# EAGLE design Dosing_CTRLR_HMI (EAGLE 9.6.2)
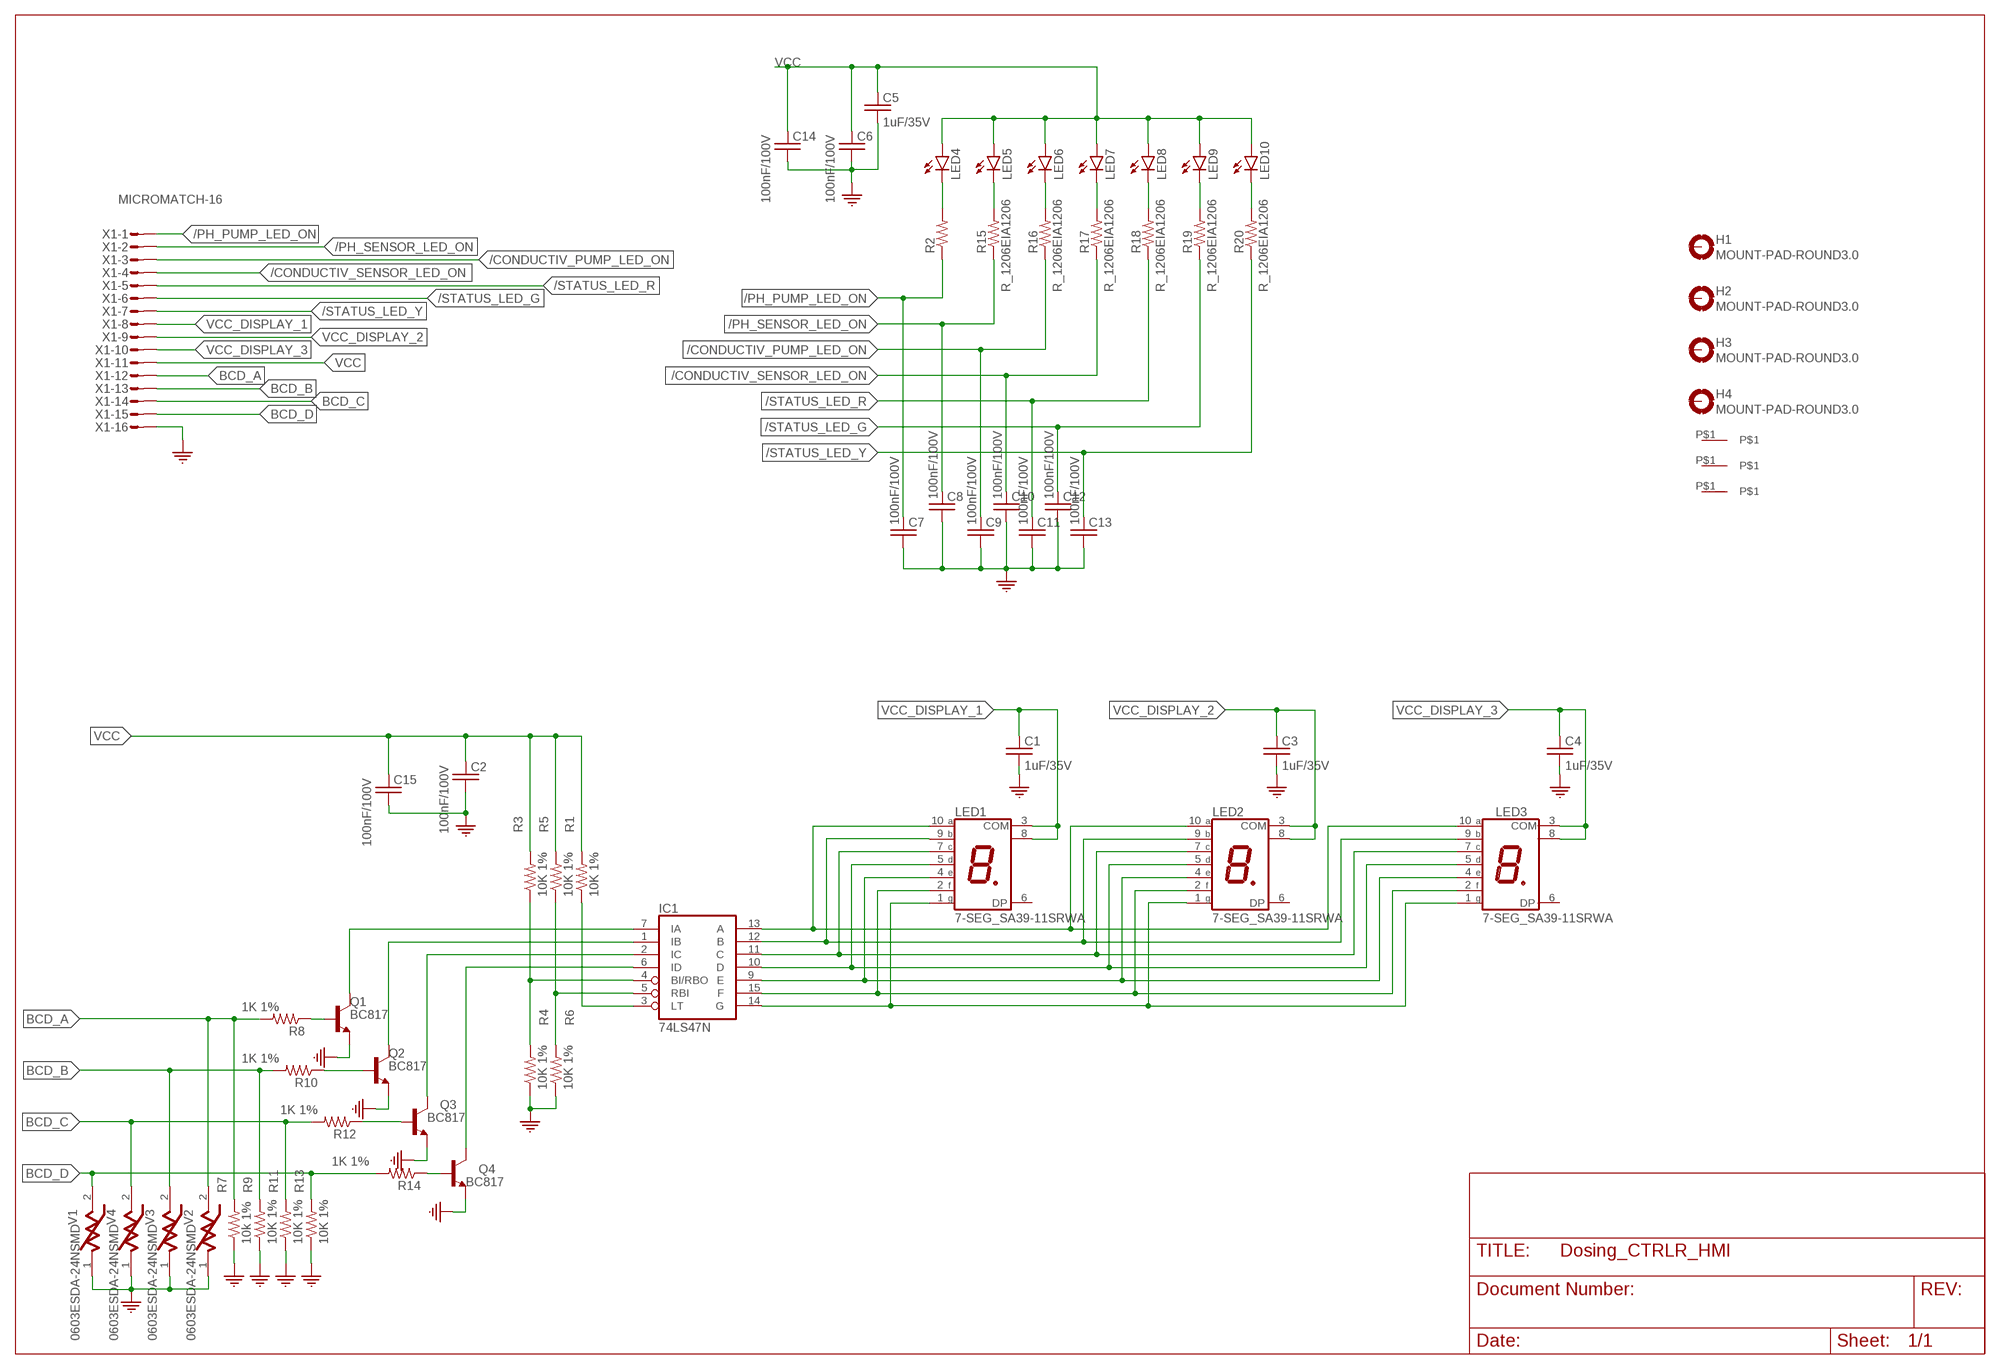
[diagram p0: schematic, sheet 1]

## Parts
C1  1uF/35V  C_0603EIA0603  [EIA0603]
C2  100nF/100V  C_0603EIA0603  [EIA0603]
C3  1uF/35V  C_0603EIA0603  [EIA0603]
C4  1uF/35V  C_0603EIA0603  [EIA0603]
C5  1uF/35V  C_0603EIA0603  [EIA0603]
C6  100nF/100V  C_0603EIA0603  [EIA0603]
C7  100nF/100V  C_0603EIA0603  [EIA0603]
C8  100nF/100V  C_0603EIA0603  [EIA0603]
C9  100nF/100V  C_0603EIA0603  [EIA0603]
C10  100nF/100V  C_0603EIA0603  [EIA0603]
C11  100nF/100V  C_0603EIA0603  [EIA0603]
C12  100nF/100V  C_0603EIA0603  [EIA0603]
C13  100nF/100V  C_0603EIA0603  [EIA0603]
C14  100nF/100V  C_0603EIA0603  [EIA0603]
C15  100nF/100V  C_0603EIA0603  [EIA0603]
FID1  FIDUCIAL  [FIDUCIAL]
FID2  FIDUCIAL  [FIDUCIAL]
FID3  FIDUCIAL  [FIDUCIAL]
H1  MOUNT-PAD-ROUND3.0  [3,0-PAD]
H2  MOUNT-PAD-ROUND3.0  [3,0-PAD]
H3  MOUNT-PAD-ROUND3.0  [3,0-PAD]
H4  MOUNT-PAD-ROUND3.0  [3,0-PAD]
IC1  74LS47N  [DIL16]
LED1  7-SEG_SA39-11SRWA  [SA39-11SRWA]
LED2  7-SEG_SA39-11SRWA  [SA39-11SRWA]
LED3  7-SEG_SA39-11SRWA  [SA39-11SRWA]
LED4  LED5MM  [LED5MM]
LED5  LED5MM  [LED5MM]
LED6  LED5MM  [LED5MM]
LED7  LED5MM  [LED5MM]
LED8  LED5MM  [LED5MM]
LED9  LED5MM  [LED5MM]
LED10  LED5MM  [LED5MM]
Q1  BC817  [SOT23]
Q2  BC817  [SOT23]
Q3  BC817  [SOT23]
Q4  BC817  [SOT23]
R1  10K 1%  R_0603  [EIA0603]
R2  R_1206EIA1206  [EIA1206]
R3  10K 1%  R_0603  [EIA0603]
R4  10K 1%  R_0603  [EIA0603]
R5  10K 1%  R_0603  [EIA0603]
R6  10K 1%  R_0603  [EIA0603]
R7  10k 1%  R_0603  [EIA0603]
R8  1K 1%  R_0603  [EIA0603]
R9  10K 1%  R_0603  [EIA0603]
R10  1K 1%  R_0603  [EIA0603]
R11  10K 1%  R_0603  [EIA0603]
R12  1K 1%  R_0603  [EIA0603]
R13  10K 1%  R_0603  [EIA0603]
R14  1K 1%  R_0603  [EIA0603]
R15  R_1206EIA1206  [EIA1206]
R16  R_1206EIA1206  [EIA1206]
R17  R_1206EIA1206  [EIA1206]
R18  R_1206EIA1206  [EIA1206]
R19  R_1206EIA1206  [EIA1206]
R20  R_1206EIA1206  [EIA1206]
V1  0603ESDA-24NSMD  [EIA0603]
V2  0603ESDA-24NSMD  [EIA0603]
V3  0603ESDA-24NSMD  [EIA0603]
V4  0603ESDA-24NSMD  [EIA0603]
X1  MICROMATCH-16  [MICROMATCH-16]

## Nets
/CONDUCTIV_PUMP_LED_ON: C9.1 R16.1 X1.3
/CONDUCTIV_SENSOR_LED_ON: C10.1 R17.1 X1.4
/PH_PUMP_LED_ON: C7.1 R2.1 X1.1
/PH_SENSOR_LED_ON: C8.1 R15.1 X1.2
/STATUS_LED_G: C12.1 R19.1 X1.6
/STATUS_LED_R: C11.1 R18.1 X1.5
/STATUS_LED_Y: C13.1 R20.1 X1.7
BCD_A: R7.2 R8.2 V2.2 X1.12
BCD_B: R9.2 R10.2 V3.2 X1.13
BCD_C: R11.2 R12.2 V4.2 X1.14
BCD_D: R13.2 R14.2 V1.2 X1.15
GND: C1.2 C2.2 C3.2 C4.2 C5.2 C6.2 C7.2 C8.2 C9.2 C10.2 C11.2 C12.2 C13.2 C14.2 C15.2 Q1.2(E) Q2.2(E) Q3.2(E) Q4.2(E) R4.1 R6.1 R7.1 R9.1 R11.1 R13.1 V1.1 V2.1 V3.1 V4.1 X1.16
N$1: IC1.13(A) LED1.10(A) LED2.10(A) LED3.10(A)
N$2: IC1.12(B) LED1.9(B) LED2.9(B) LED3.9(B)
N$3: IC1.11(C) LED1.7(C) LED2.7(C) LED3.7(C)
N$4: IC1.10(D) LED1.5(D) LED2.5(D) LED3.5(D)
N$5: IC1.9(E) LED1.4(E) LED2.4(E) LED3.4(E)
N$6: IC1.15(F) LED1.2(F) LED2.2(F) LED3.2(F)
N$7: IC1.14(G) LED1.1(G) LED2.1(G) LED3.1(G)
N$8: IC1.4(BI/RBO) R3.1 R4.2
N$9: IC1.3(LT) R1.1
N$10: Q4.1(B) R14.1
N$11: IC1.5(RBI) R5.1 R6.2
N$13: Q3.1(B) R12.1
N$14: LED4.K(C) R2.2
N$15: Q2.1(B) R10.1
N$16: LED5.K(C) R15.2
N$17: LED6.K(C) R16.2
N$18: Q1.1(B) R8.1
N$19: IC1.7(IA) Q1.3(C)
N$20: IC1.1(IB) Q2.3(C)
N$21: IC1.2(IC) Q3.3(C)
N$22: IC1.6(ID) Q4.3(C)
N$23: LED7.K(C) R17.2
N$24: LED8.K(C) R18.2
N$25: LED9.K(C) R19.2
N$26: LED10.K(C) R20.2
VCC: C2.1 C5.1 C6.1 C14.1 C15.1 LED4.A LED5.A LED6.A LED7.A LED8.A LED9.A LED10.A R1.2 R3.2 R5.2 X1.11
VCC_DISPLAY_1: C1.1 LED1.3(COM) LED1.8(COM) X1.8
VCC_DISPLAY_2: C3.1 LED2.3(COM) LED2.8(COM) X1.9
VCC_DISPLAY_3: C4.1 LED3.3(COM) LED3.8(COM) X1.10
Unconnected: FID1.P$1 FID2.P$1 FID3.P$1 H1.B3,0(MOUNT) H2.B3,0(MOUNT) H3.B3,0(MOUNT) H4.B3,0(MOUNT) LED1.6(DP) LED2.6(DP) LED3.6(DP)

## Power pins joined to a net without a drawn wire
GND: IC1.8(GND)
VCC: IC1.16(VCC)

## Library data of the parts
C1-C15 = Labops_Lib_AH:C_0603
FID1-FID3 = Labops_Lib_AH:FIDUCIAL
H1-H4 = holes:MOUNT-PAD-ROUND: MOUNTING PAD, round
IC1 = 74xx-us:74*47: BCD to seven segment DECODER/DRIVER Source: http://www.ee.washington.edu/stores/DataSheets/74ls/74ls47.pdf
LED1-LED3 = display-kingbright:7-SEG_: Kingbright 14.2mm (0.56 INCH) SINGLE DIGIT NUMERIC DUISPLAY Source: SA56-11EWA(Ver1189471036.pdf; OC_FARNELL: unknown; OC_NEWARK: unknown
LED4-LED10 = led:LED: LED OSRAM: - CHIPLED LG R971, LG N971, LY N971, LG Q971, LY Q971, LO R971, LY R971 LH N974, LH R974 LS Q976, LO Q976, LY Q976 LO Q996 - Hyper CHIPLED LW Q18S LB Q993, LB Q99A, LB R99A - SideLED LS A670, LO A670, LY A670, LG A670, LP A670 LB A673, LV A673, LT A673, LW A673 LH A674 LY A675 LS A676, LA A676, LO A676, LY A676, LW A676 LS A679, LY A679, LG A679 - Hyper Micro SIDELED® LS Y876, LA Y876, LO Y876, LY Y876 LT Y87S - SmartLED LW L88C, LW L88S LB L89C, LB L89S, LG L890 LS L89K, LO L89K, LY L89K LS L896, LA L896, LO L896, LY L896 - TOPLED LS T670, LO T670, LY T670, LG T670, LP T670 LSG T670, LSP T670, LSY T670, LOP T670, LYG T670 LG T671, LOG T671, LSG T671 LB T673, LV T673, LT T673, LW T673 LH T674 LS T676, LA T676, LO T676, LY T676, LB T676, LH T676, LSB T676, LW T676 LB T67C, LV T67C, LT T67C, LS T67K, LO T67K, LY T67K, LW E67C LS E67B, LA E67B, LO E67B, LY E67B, LB E67C, LV E67C, LT E67C LW T67C LS T679, LY T679, LG T679 LS T770, LO T770, LY T770, LG T770, LP T770 LB T773, LV T773, LT T773, LW T773 LH T774 LS E675, LA E675, LY E675, LS T675 LS T776, LA T776, LO T776, LY T776, LB T776 LHGB T686 LT T68C, LB T68C - Hyper Mini TOPLED® LB M676 - Mini TOPLED Santana® LG M470 LS M47K, LO M47K, LY M47K Source: http://www.osram.convergy.de LUXEON: - LUMILED® LXK2-PW12-R00, LXK2-PW12-S00, LXK2-PW14-U00, LXK2-PW14-V00 LXK2-PM12-R00, LXK2-PM12-S00, LXK2-PM14-U00 LXK2-PE12-Q00, LXK2-PE12-R00, LXK2-PE12-S00, LXK2-PE14-T00, LXK2-PE14-U00 LXK2-PB12-K00, LXK2-PB12-L00, LXK2-PB12-M00, LXK2-PB14-N00, LXK2-PB14-P00, LXK2-PB14-Q00 LXK2-PR12-L00, LXK2-PR12-M00, LXK2-PR14-Q00, LXK2-PR14-R00 LXK2-PD12-Q00, LXK2-PD12-R00, LXK2-PD12-S00 LXK2-PH12-R00, LXK2-PH12-S00 LXK2-PL12-P00, LXK2-PL12-Q00, LXK2-PL12-R00 Source: www.luxeon.com KINGBRIGHT: KA-3528ASYC Source: www.kingbright.com
Q1-Q4 = Labops_Lib_AH:BC817; DESCRIPTION: Transistor BJT NPN SOT23 45V 0.5A; MFN: BC817; MFR: NXP; PRICE-1: 0.03; SUPPLIER-1: Mouser
R1 R3-R14 = Labops_Lib_AH:R_0603; MFN: Open Source 0603
R2 R15-R20 = Labops_Lib_AH:R_1206; MFN: Open Source R1206
V1-V4 = Labops_Lib_AH:0603ESDA-24N; DESCRIPTION: aristor 0603 SMD Bidirectional 50V 24V; MFN: 0603ESDA-24N; MFR: Bourns; SUPPLIER-1: LCSC
X1 = con-amp-micromatch:MICROMATCH-16: MicroMaTch 16 8-215464-6 / 1-215464-6 Drawing Number C-215464 DDEController.pdf; MF: FARNELL; MPN: 8-215464-6; OC_FARNELL: 3784680; OC_NEWARK: 26H3309

## Board
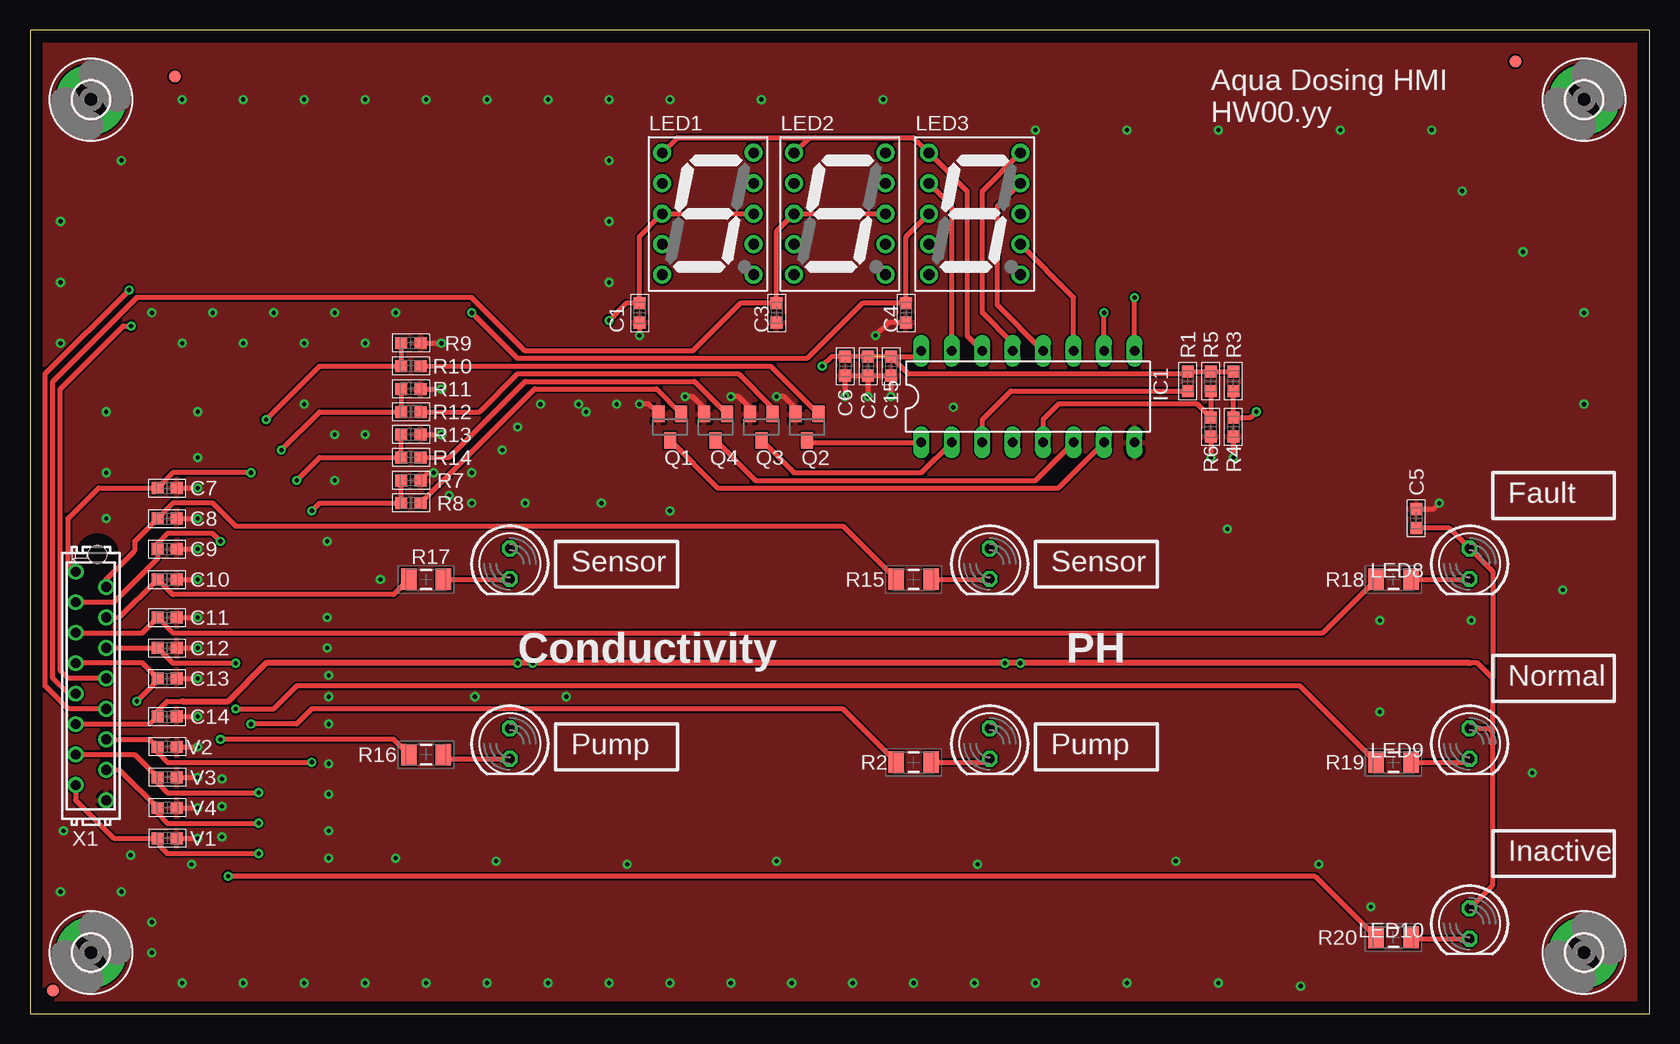
[diagram p1: board, top side]
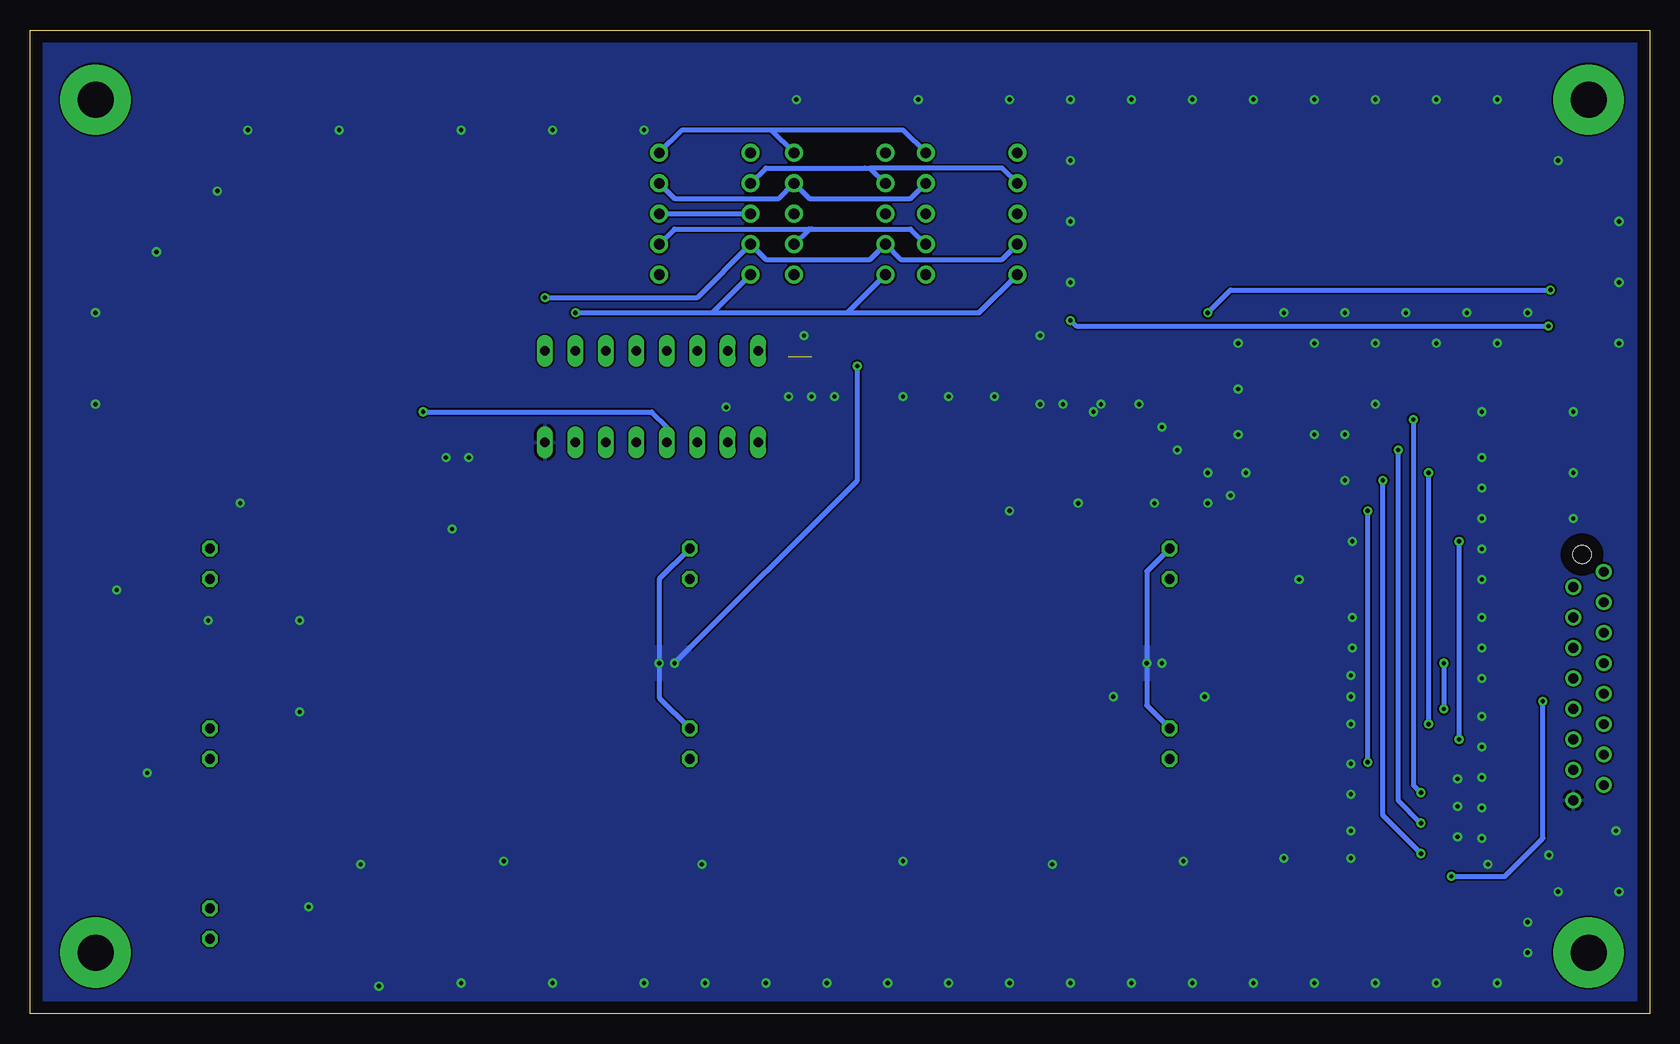
[diagram p2: board, bottom side, seen from below]

Size 135 x 82 mm. Coordinates in mm from the lower left corner, seen from the top.
Outline: 0,0 135,0 135,82 0,82 0,0
Copper layers (1*16): Top 0.035mm / dielectric 1.5mm / Bottom 0.035mm
Design rules "default *": minimum track width 6mil, minimum drill 0.35mm, track to track 6mil, track to pad 6mil, pad to pad 6mil, via to via 6mil, smd to smd 6mil, copper to edge 40mil, drill to drill 6mil, minimum pad ring 10mil, minimum via ring 8mil, stop-mask expansion 4mil, vias tented up to drill 0.35mm, thermal gap 10mil

### Footprints (pad centres in the part's own frame; a part is rotated, then mirrored left to right if it is on the bottom)
EIA0603 = smd 1 x 1: 1 -0.8,0; 2 0.8,0
FIDUCIAL = smd 1 x 1: P$1 0,0
3,0-PAD = drill 3 pad 5.842: B3,0 0,0
DIL16 = drill 0.813 long: 1 -8.89,-3.81; 2 -6.35,-3.81; 3 -3.81,-3.81; 4 -1.27,-3.81; 5 1.27,-3.81; 6 3.81,-3.81; 7 6.35,-3.81; 8 8.89,-3.81; 9 8.89,3.81; 10 6.35,3.81; 11 3.81,3.81; 12 1.27,3.81; 13 -1.27,3.81; 14 -3.81,3.81; 15 -6.35,3.81; 16 -8.89,3.81
SA39-11SRWA = drill 0.9 pad 1.5: 1 -3.81,5.08; 2 -3.81,2.54; 3 -3.81,0; 4 -3.81,-2.54; 5 -3.81,-5.08; 6 3.81,-5.08; 7 3.81,-2.54; 8 3.81,0; 9 3.81,2.54; 10 3.81,5.08
LED5MM = drill 0.813 octagon: A -1.27,0; K 1.27,0
SOT23 = smd 1 x 1.4: 1 -0.95,-1.1; 2 0.95,-1.1; 3 0,1.1
EIA1206 = smd 1.3 x 1.8: 1 -1.45,0; 2 1.45,0
MICROMATCH-16 = drill 0.813: 1 9.525,1.27; 2 8.255,-1.27; 3 6.985,1.27; 4 5.715,-1.27; 5 4.445,1.27; 6 3.175,-1.27; 7 1.905,1.27; 8 0.635,-1.27; 9 -0.635,1.27; 10 -1.905,-1.27; 11 -3.175,1.27; 12 -4.445,-1.27; 13 -5.715,1.27; 14 -6.985,-1.27; 15 -8.255,1.27; 16 -9.525,-1.27 | hole 1.5: 10.97,-0.55

### Placement (x,y rotation side)
C1  50.8,58.42 270 top
C2  69.85,53.98 270 top
C3  62.23,58.42 270 top
C4  73.03,58.42 270 top
C5  115.57,41.27 90 top
C6  67.94,53.98 270 top
C7  11.43,43.81 0 top
C8  11.43,41.27 0 top
C9  11.43,38.73 0 top
C10  11.43,36.2 0 top
C11  11.43,33.02 0 top
C12  11.43,30.48 0 top
C13  11.43,27.94 0 top
C14  11.43,24.77 0 top
C15  71.75,53.98 270 top
FID1  1.91,1.91 0 top
FID2  123.83,79.38 0 top
FID3  12.06,78.11 0 top
H1  129.54,5.08 0 top
H2  129.54,76.2 0 top
H3  5.08,76.2 0 top
H4  5.08,5.08 0 top
IC1  83.19,51.44 0 top
LED1  56.52,66.67 0 top
LED2  67.5,66.67 0 top
LED3  78.74,66.67 0 top
LED4  80,22.5 270 top
LED5  80,37.5 270 top
LED6  40,22.5 270 top
LED7  40,37.5 270 top
LED8  120,37.5 270 top
LED9  120,22.5 270 top
LED10  120,7.5 270 top
Q1  53.34,48.9 180 top
Q2  64.77,48.9 180 top
Q3  60.96,48.9 180 top
Q4  57.15,48.9 180 top
R1  96.52,52.7 90 top
R2  73.66,20.95 0 top
R3  100.33,52.7 90 top
R4  100.33,48.9 90 top
R5  98.42,52.7 90 top
R6  98.42,48.9 90 top
R7  31.75,44.45 180 top
R8  31.75,42.55 180 top
R9  31.75,55.88 180 top
R10  31.75,53.98 180 top
R11  31.75,52.07 180 top
R12  31.75,50.16 180 top
R13  31.75,48.26 180 top
R14  31.75,46.35 180 top
R15  73.66,36.2 0 top
R16  33.02,21.59 0 top
R17  33.02,36.2 0 top
R18  113.67,36.2 0 top
R19  113.67,20.95 0 top
R20  113.67,6.35 0 top
V1  11.43,14.61 180 top
V2  11.43,22.23 180 top
V3  11.43,19.68 180 top
V4  11.43,17.14 180 top
X1  5.08,27.3 90 top

### Tracks (layer width: path | path; a pad name or v marks a point on that pad's centre or on a via)
/CONDUCTIV_PUMP_LED_ON  (via drill 0.35)
  Top 0.406: X1.3 6.99,34.29 10.63,37.94 C9.1 10.63,39.2 11.43,40.01 15.24,40.01 v15.88,39.37 | R16.1 30.3,22.86 v15.88,22.86
  Bottom 0.406: v15.88,22.86 v15.88,39.37
/CONDUCTIV_SENSOR_LED_ON
  Top 0.406: R17.1 30.3,34.92 11.9,34.92 C10.1 7.46,33.02 X1.4
/PH_PUMP_LED_ON  (via drill 0.35)
  Top 0.406: R2.1 67.77,25.4 23.5,25.4 22.23,24.13 v18.41,24.13 | X1.1 3.17,37.47 3.17,41.27 5.71,43.81 C7.1 11.9,45.09 v18.41,45.09
  Bottom 0.406: v18.41,24.13 v18.41,45.09
/PH_SENSOR_LED_ON
  Top 0.406: R15.1 67.77,40.64 17.14,40.64 15.24,42.55 11.9,42.55 C8.1 8.72,39.37 8.72,38.57 6.35,36.2 X1.2
/STATUS_LED_G  (via drill 0.35)
  Top 0.406: X1.6 C12.1 11.9,29.21 v17.14,29.21 | R19.1 105.86,27.3 22.23,27.3 20.32,25.4 v17.14,25.4
  Bottom 0.406: v17.14,29.21 v17.14,25.4
/STATUS_LED_R
  Top 0.406: R18.1 107.77,31.75 11.9,31.75 C11.1 9.36,31.75 X1.5
/STATUS_LED_Y  (via drill 0.35)
  Top 0.406: R20.1 107.14,11.43 v16.51,11.43 | X1.7 9.36,29.21 C13.1 10.63,27.77 v8.89,26.04
  Bottom 0.406: v16.51,11.43 12.06,11.43 8.89,14.61 v8.89,26.04
BCD_A  (via drill 0.35)
  Top 0.406: X1.12 9.99,22.86 V2.2 10.63,21.75 11.43,20.95 v23.5,20.95 | v23.5,41.91 24.13,42.55 R8.2 R7.2
  Bottom 0.406: v23.5,20.95 v23.5,41.91
BCD_B  (via drill 0.35)
  Top 0.406: X1.13 8.72,21.59 V3.2 10.63,19.21 11.43,18.41 v19.05,18.41 | v19.68,49.53 24.13,53.98 R10.2 R9.2
  Bottom 0.406: v19.05,18.41 19.68,19.05 v19.68,49.53
BCD_C  (via drill 0.35)
  Top 0.406: X1.14 7.46,20.32 V4.2 10.63,16.68 11.43,15.88 v19.05,15.88 | v20.95,46.99 24.13,50.16 R12.2 R11.2
  Bottom 0.406: v20.95,46.99 20.95,17.78 v19.05,15.88
BCD_D  (via drill 0.35)
  Top 0.406: X1.15 3.81,17.78 6.99,14.61 V1.2 10.79,14.44 10.79,13.97 11.43,13.34 v19.05,13.34 | v22.23,44.45 24.13,46.35 R14.2 R13.2
  Bottom 0.406: v22.23,44.45 22.23,16.51 v19.05,13.34
GND  (via drill 0.35)
  Top 0.406: R9.1 v34.29,55.88 | R11.1 v34.29,52.07 | R13.1 v34.29,48.26 | R7.1 33.19,45.09 v33.66,45.09 | C7.2 v13.97,43.81 | C8.2 v13.97,41.27 | C9.2 v13.97,38.73 | C10.2 v13.97,36.2 | C11.2 v13.97,33.02 | C12.2 v13.97,30.48 | C13.2 v13.97,27.94 | C14.2 v13.97,24.77 | V2.1 v13.97,22.23 | V3.1 v13.97,19.68 | V4.1 v13.97,17.14 | V1.1 v13.97,14.61 | C1.2 v50.8,56.52 | Q4.2 56.2,50.48 55.24,51.44 v54.61,51.44 | Q3.2 60.01,50.48 59.05,51.44 v58.42,51.44 | Q2.2 63.82,50.48 62.87,51.44 v62.23,51.44 | Q1.2 51.59,50.8 v50.8,50.8 | C2.2 v69.85,51.44 | v67.94,51.44 C6.2 C15.2 v71.75,51.44 | R4.1 v100.33,46.35 | R6.1 v98.42,46.35 | C5.2 117,42.08 v117.47,42.55 | C4.2 71.59,57.62 v70.48,56.52
  other vias: 6.35,41.27 6.35,45.09 6.35,50.16 13.97,50.16 13.97,46.35 24.77,39.37 29.21,36.2 24.77,33.02 24.77,30.48 24.89,28.19 24.89,26.42 37.08,26.42 44.7,26.42 24.89,24.13 24.89,20.83 16,14.73 16,17.27 16,19.56 2.79,15.24 8.38,13.21 13.46,12.45 24.89,18.29 24.89,15.24 24.89,12.95 30.48,12.95 38.86,12.7 49.78,12.45 62.23,12.7 78.99,12.45 95.5,12.7 107.44,12.45 111.76,8.89 105.92,2.29 83.82,2.54 91.44,2.54 99.06,2.54 78.74,2.54 73.66,2.54 68.58,2.54 63.5,2.54 58.42,2.54 53.34,2.54 48.26,2.54 43.18,2.54 38.1,2.54 33.02,2.54 27.94,2.54 22.86,2.54 17.78,2.54 12.7,2.54 2.54,10.16 7.62,10.16 10.16,7.62 10.16,5.08 112.52,25.15 112.52,32.77 120.14,32.77 125.22,20.07 127.76,35.31 99.82,40.39 76.96,50.55 116.84,73.66 119.38,68.58 124.46,63.5 129.54,58.42 129.54,50.8 109.22,73.66 99.06,73.66 91.44,73.66 83.82,73.66 71.12,76.2 60.96,76.2 53.34,76.2 48.26,76.2 48.26,71.12 48.26,66.04 48.26,60.96 43.18,76.2 38.1,76.2 33.02,76.2 27.94,76.2 22.86,76.2 17.78,76.2 12.7,76.2 7.62,71.12 2.54,66.04 2.54,60.96 2.54,55.88 20.32,58.42 25.4,58.42 30.48,58.42 15.24,58.42 10.16,58.42 17.78,55.88 22.86,55.88 27.94,55.88 12.7,55.88 22.86,50.8 27.94,48.26 25.4,48.26 25.4,44.45 36.83,42.55 41.27,42.55 47.62,42.55 53.34,41.91 46.35,50.16 42.55,50.8 45.72,50.8 48.9,50.8 40.64,48.9 39.37,46.99 36.83,45.09 34.92,43.18
  pour Top (rank 2): 0.64,81.28 0.64,0.64 134.62,0.64 134.62,81.28
  pour Bottom: 0.64,81.28 0.64,0.64 134.62,0.64 134.62,81.28
N$1
  Top 0.406: IC1.13 81.92,55.88 79.38,58.42 79.38,68.58 LED3.10
  Bottom 0.406: LED1.10 62.23,73.66 73.22,73.66 | 73.22,73.66 80.64,73.66 LED3.10 | LED2.10 73.22,73.66
N$2
  Top 0.406: LED3.9 80.64,67.31 80.64,59.05 IC1.12
  Bottom 0.406: LED3.9 81.28,67.94 72.58,67.94 LED2.9 70.04,67.94 61.59,67.94 LED1.9
N$3
  Top 0.406: IC1.11 87,59.69 LED3.7
  Bottom 0.406: LED3.7 81.28,65.41 70.04,65.41 | LED1.7 61.59,65.41 69.85,65.41 70.04,65.41 | LED2.7 70.04,65.41
N$4  (via drill 0.35)
  Top 0.406: IC1.10 v89.53,58.42
  Bottom 0.406: v89.53,58.42 78.11,58.42 | 78.11,58.42 LED3.5 | 78.11,58.42 66.86,58.42 | 66.86,58.42 LED2.5 | 66.86,58.42 55.88,58.42 LED1.5
N$5  (via drill 0.35)
  Top 0.406: IC1.9 v92.08,59.69
  Bottom 0.406: v92.08,59.69 79.38,59.69 LED3.4 73.66,62.87 64.96,62.87 LED2.4 62.42,62.87 53.98,62.87 LED1.4
N$6
  Top 0.406: IC1.15 76.83,67.31 LED3.2
  Bottom 0.406: LED3.2 73.66,70.48 65.41,70.48 64.96,70.48 | 64.96,70.48 LED2.2 | LED1.2 53.98,70.48 64.96,70.48
N$7
  Top 0.406: IC1.14 78.11,56.52 78.11,68.58 LED3.1 73.66,73.03 65.41,73.03 64.96,73.03 | LED1.1 53.98,73.03 64.96,73.03 | LED2.1 64.96,73.03
N$8  (via drill 0.35)
  Top 0.406: R3.1 R4.2 101.77,49.7 v102.23,50.16
  Bottom 0.406: v102.23,50.16 83.19,50.16 81.92,48.9 IC1.4
N$9
  Top 0.406: IC1.3 79.38,49.53 81.75,51.91 R1.1
N$10
  Top 0.406: R14.1 34.92,46.35 41.27,52.7 55.39,52.7 Q4.1
N$11
  Top 0.406: R5.1 R6.2 97.32,50.8 85.72,50.8 84.45,49.53 IC1.5
N$13
  Top 0.406: R12.1 37.47,50.16 40.64,53.34 59.05,53.34 61.91,50.48 Q3.1
N$14
  Top 0.406: R2.2 79.72,20.95 LED4.K
N$15
  Top 0.406: Q2.1 61.74,53.98 R10.1
N$16
  Top 0.406: R15.2 79.97,36.2 LED5.K
N$17
  Top 0.406: R16.2 34.83,21.23 LED6.K
N$18
  Top 0.406: R8.1 42.08,52.07 52.22,52.07 Q1.1
N$19
  Top 0.406: Q1.3 57.32,43.81 85.72,43.81 IC1.7
N$20
  Top 0.406: Q2.3 64.94,47.62 IC1.1
N$21
  Top 0.406: Q3.3 63.67,45.09 74.3,45.09 IC1.2
N$22
  Top 0.406: Q4.3 60.49,44.45 83.82,44.45 IC1.6
N$23
  Top 0.406: R17.2 39.97,36.2 LED7.K
N$24
  Top 0.406: R18.2 119.97,36.2 LED8.K
N$25
  Top 0.406: R19.2 119.72,20.95 LED9.K
N$26
  Top 0.406: R20.2 115.23,6.23 LED10.K
VCC  (via drill 0.35)  (1 unrouted)
  Top 0.406: 120.02,23.79 LED9.A 121.64,23.77 121.92,23.5 | 12.7,26.04 11.43,26.04 10.63,25.23 C14.1 9.99,24.13 X1.11 | C15.1 73.19,53.34 96.36,53.34 R1.2 R5.2 R3.2 | C15.1 C6.1 66.84,54.77 v66.04,53.98 | C15.1 73.83,54.77 IC1.16 | LED10.A 121.92,10.69 121.92,23.5 | 121.92,23.5 121.92,27.94 | 121.92,27.94 120.65,29.21 120.02,29.21 | 121.92,27.94 121.92,36.85 LED8.A 118.3,40.48 C5.1
  Top 0.508: 12.7,26.04 16.51,26.04 19.68,29.21 v40.64,29.21 v41.91,29.21 v81.28,29.21 v82.55,29.21 120.02,29.21
  Bottom 0.406: LED7.A 41.91,36.86 v41.91,29.21 41.91,25.68 LED6.A | LED5.A 82.55,36.22 v82.55,29.21 82.55,26.32 LED4.A | v81.28,29.21 66.04,44.45 v66.04,53.98
  pour Bottom: 40.01,30.48 43.81,30.48 43.81,27.94 40.01,27.94
  pour Bottom: 80.01,30.48 83.82,30.48 83.82,27.94 80.01,27.94
VCC_DISPLAY_1  (via drill 0.35)
  Top 0.406: LED1.8 LED1.3 50.8,64.77 C1.1 49.7,59.22 v48.26,57.78 | X1.8 3.17,27.94 2.54,28.57 2.54,52.07 7.79,57.31 v8.42,57.31
  Bottom 0.406: v48.26,57.78 47.79,57.31 v8.42,57.31
VCC_DISPLAY_2
  Top 0.406: LED2.8 LED2.3 62.23,65.22 C3.1 59.22,59.22 55.24,55.24 41.27,55.24 36.83,59.69 8.89,59.69 1.91,52.7 1.91,27.94 3.17,26.67 X1.9
VCC_DISPLAY_3  (via drill 0.35)
  Top 0.406: LED3.3 73.03,64.77 C4.1 69.38,59.22 64.77,54.61 40.64,54.61 v36.83,58.42 | X1.10 3.17,25.4 1.27,27.3 1.27,53.34 v8.26,60.33
  Bottom 0.406: LED3.8 LED3.3 | v36.83,58.42 34.92,60.33 v8.26,60.33

### Text on the board
tPlace: Aqua Dosing HMI / HW00.yy | Fault | Sensor | Sensor | Conductivity | PH | Normal | Pump | Pump | Inactive